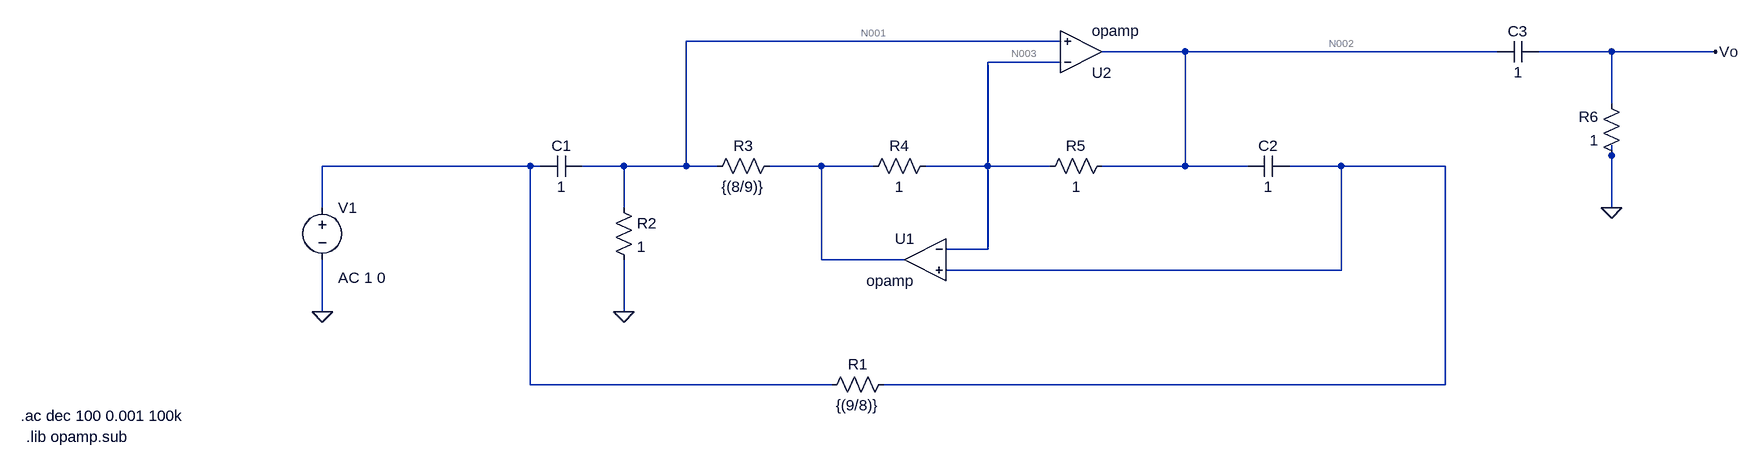
[diagram p0: schematic Circ1.asc]
Circ1.asc, the LTspice schematic file:
Version 4
SHEET 1 2000 680
WIRE 944 -32 368 -32
WIRE 1136 -16 1008 -16
WIRE 1616 -16 1136 -16
WIRE 1792 -16 1680 -16
WIRE 1952 -16 1792 -16
WIRE 944 0 832 0
WIRE 1792 64 1792 -16
WIRE 1792 144 1792 128
WIRE 128 160 -192 160
WIRE 144 160 128 160
WIRE 272 160 208 160
WIRE 368 160 368 -32
WIRE 368 160 272 160
WIRE 416 160 368 160
WIRE 576 160 496 160
WIRE 656 160 576 160
WIRE 832 160 832 0
WIRE 832 160 736 160
WIRE 928 160 832 160
WIRE 1136 160 1136 -16
WIRE 1136 160 1008 160
WIRE 1232 160 1136 160
WIRE 1376 160 1296 160
WIRE 1536 160 1376 160
WIRE -192 224 -192 160
WIRE 272 224 272 160
WIRE 1792 224 1792 144
WIRE 832 288 832 160
WIRE 832 288 768 288
WIRE 576 304 576 160
WIRE 704 304 576 304
WIRE 1376 320 1376 160
WIRE 1376 320 768 320
WIRE -192 384 -192 304
WIRE 272 384 272 304
WIRE 128 496 128 160
WIRE 592 496 128 496
WIRE 1536 496 1536 160
WIRE 1536 496 672 496
FLAG 272 384 0
FLAG 1952 -16 Vo
FLAG 1792 224 0
FLAG -192 384 0
SYMBOL cap 208 144 R90
WINDOW 0 0 32 VBottom 2
WINDOW 3 32 32 VTop 2
SYMATTR InstName C1
SYMATTR Value 1
SYMBOL res 688 480 R90
WINDOW 0 0 56 VBottom 2
WINDOW 3 32 56 VTop 2
SYMATTR InstName R1
SYMATTR Value {(9/8)}
SYMBOL res 256 208 R0
SYMATTR InstName R2
SYMATTR Value 1
SYMBOL res 512 144 R90
WINDOW 0 0 56 VBottom 2
WINDOW 3 32 56 VTop 2
SYMATTR InstName R3
SYMATTR Value {(8/9)}
SYMBOL res 752 144 R90
WINDOW 0 0 56 VBottom 2
WINDOW 3 32 56 VTop 2
SYMATTR InstName R4
SYMATTR Value 1
SYMBOL OpAmps\\opamp 736 240 M0
SYMATTR InstName U1
SYMBOL res 1024 144 R90
WINDOW 0 0 56 VBottom 2
WINDOW 3 32 56 VTop 2
SYMATTR InstName R5
SYMATTR Value 1
SYMBOL cap 1296 144 R90
WINDOW 0 0 32 VBottom 2
WINDOW 3 32 32 VTop 2
SYMATTR InstName C2
SYMATTR Value 1
SYMBOL OpAmps\\opamp 976 48 M180
SYMATTR InstName U2
SYMBOL cap 1680 -32 R90
WINDOW 0 0 32 VBottom 2
WINDOW 3 32 32 VTop 2
SYMATTR InstName C3
SYMATTR Value 1
SYMBOL res 1808 160 R180
WINDOW 0 36 76 Left 2
WINDOW 3 36 40 Left 2
SYMATTR InstName R6
SYMATTR Value 1
SYMBOL voltage -192 208 R0
WINDOW 123 24 124 Left 2
WINDOW 39 0 0 Left 0
SYMATTR Value2 AC 1 0
SYMATTR InstName V1
SYMATTR Value ""
TEXT -656 544 Left 2 !.ac dec 100 0.001 100k
TEXT -648 576 Left 2 !.lib opamp.sub

The netlist it stands for:
* Circ1.asc
C1 N001 N004 1
R1 N006 N004 {(9/8)}
R2 N001 0 1
R3 N005 N001 {(8/9)}
R4 N003 N005 1
XU1 N003 N006 N005 opamp Aol=100K GBW=10Meg  ; pins invin noninvin out
R5 N002 N003 1
C2 N006 N002 1
XU2 N003 N001 N002 opamp Aol=100K GBW=10Meg  ; pins invin noninvin out
C3 Vo N002 1
R6 0 Vo 1
V1 N004 0 AC 1 0
.ac dec 100 0.001 100k
.lib opamp.sub
.backanno
.end

* Results of the author's LTspice run, read from the files saved beside the schematic
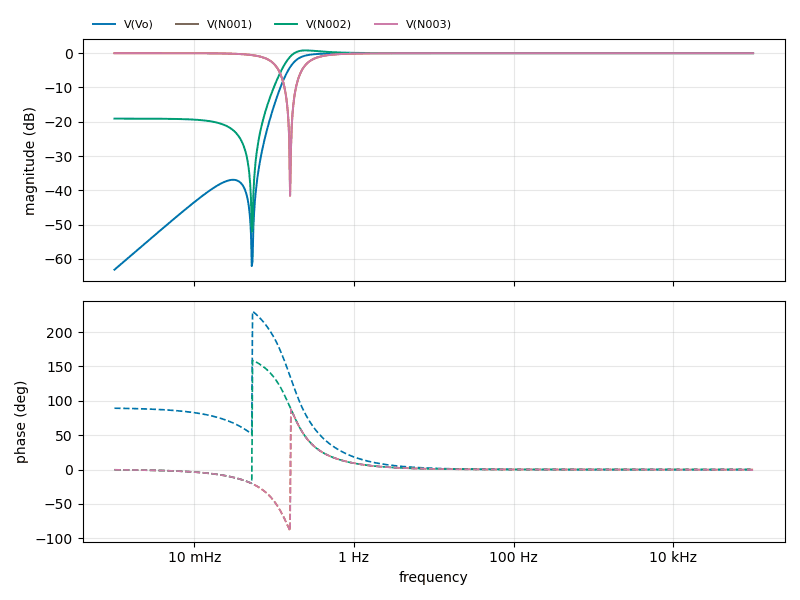
[diagram p1: AC Analysis of Circ1.asc, plotted from the saved traces]
* AC Analysis, 1 run:
*   V(Vo): -63.12 dB at 1 mHz, 0.00 dB at 100 kHz, peak 0.00 dB at 100 kHz, 3 dB below the peak at 171.7 mHz
*   V(N001): -0.00 dB at 1 mHz, -0.00 dB at 100 kHz, peak -0.00 dB at 100 kHz, 3 dB below the peak at 257.5 mHz
*   V(N002): -19.09 dB at 1 mHz, 0.00 dB at 100 kHz, peak 0.80 dB at 245.5 mHz, 3 dB below the peak at 144.9 mHz
*   V(N003): -0.00 dB at 1 mHz, 0.00 dB at 100 kHz, peak 0.00 dB at 100 kHz, 3 dB below the peak at 257.6 mHz